# EAGLE design Buzzer_Card (EAGLE 6.4)

## Sheet 1 of 2
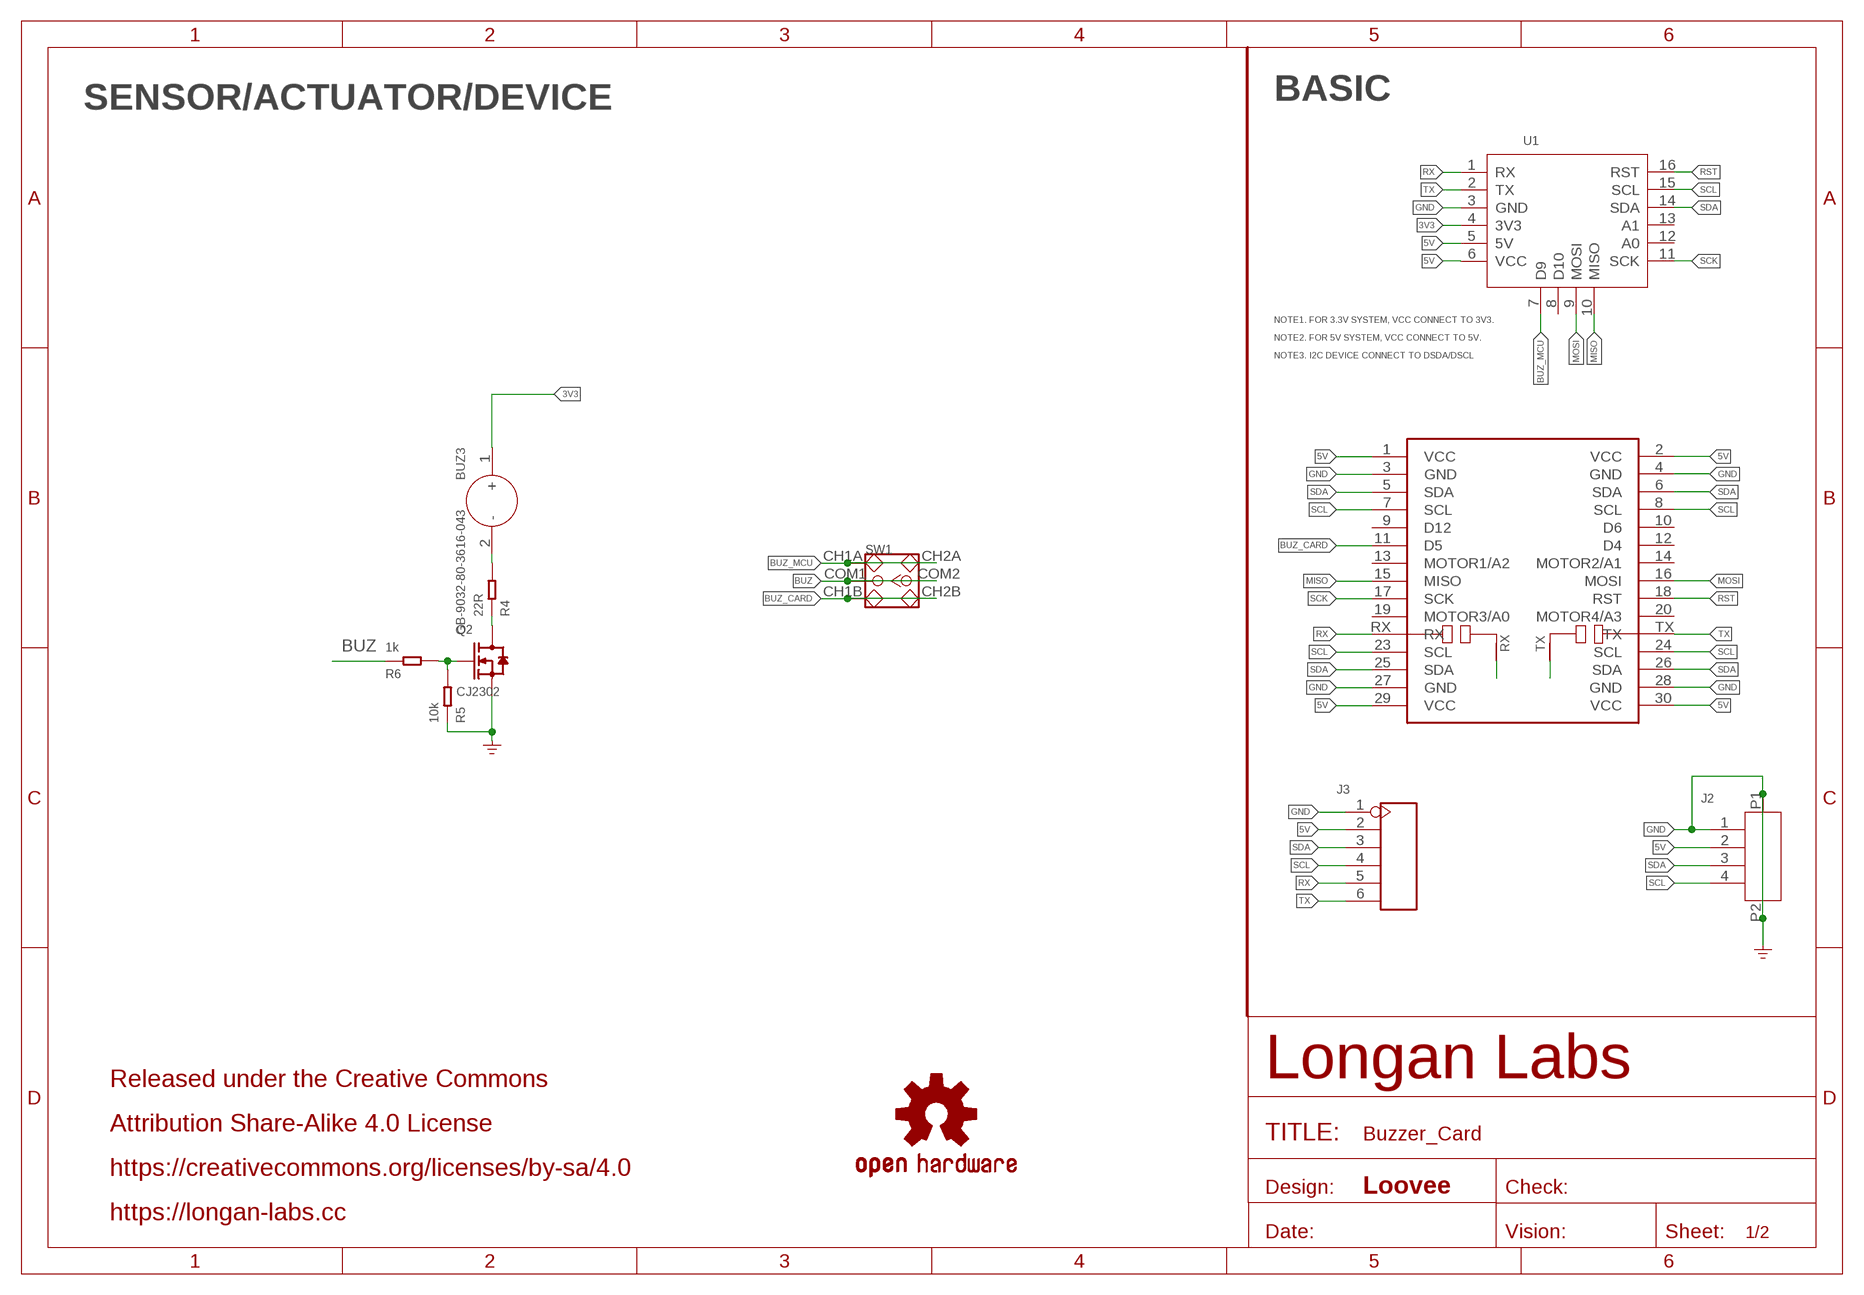
[diagram p0: schematic, sheet 1]

### Parts
BUZ3  GB-9032-80-3616-043  BUZZER-9X3.2MM  [BZ2-SMD-9X10.6X3.2MM]
J2  HEADER-4P-1.0  [4P-1.0-90D]
J3  HEADER-6P-55/35MIL  [H6-2.54]
LOGO2  OSHW-LOGOS  [OSHW-LOGO-S]
MOUDLE2  MOUDLE-CARDS-UART'BOARD'  [MOUDLE-2X15P-UART]
Q2  CJ2302  MOSFET-N'SOT23'  [SOT-23]
R4  22R  RES-0603  [R0603]
R5  10k  RES-0603  [R0603]
R6  1k  RES-0603  [R0603]
SW1  SWITCH-2CH-6P-SMD  [SW6-2.54-SMD-7.0X3.5X1.5MM]
U1  MOUDLE-CARDS  [16P-2.0-CARDS]

### Nets
3V3: BUZ3.1(+) U1.4(3V3)
5V: J2.2 J3.2 MOUDLE2.1(VCC) MOUDLE2.2(VCC) MOUDLE2.29(VCC) MOUDLE2.30(VCC) U1.5(5V) U1.6(VCC)
BUZ: R6.1 SW1.COM1 SW1.COM2
BUZ_CARD: MOUDLE2.11(D5) SW1.CH1B SW1.CH2B
BUZ_MCU: SW1.CH1A SW1.CH2A U1.7(D9)
GND: J2.1 J2.P1 J2.P2 J3.1 MOUDLE2.3(GND) MOUDLE2.4(GND) MOUDLE2.27(GND) MOUDLE2.28(GND) Q2.2(S) R5.1 U1.3(GND) ; supply symbol labelled GND_POWER
MISO: MOUDLE2.15(MISO) U1.10(MISO)
MOSI: MOUDLE2.16(MOSI) U1.9(MOSI)
N$1: Q2.3(D) R4.1
N$2: MOUDLE2.RX/N1(RX/N) MOUDLE2.RX/N2(RX/N)
N$3: Q2.1(G) R5.2 R6.2
N$4: BUZ3.2(-) R4.2
N$5: MOUDLE2.TX/N1(TX/N) MOUDLE2.TX/N2(TX/N)
RST: MOUDLE2.18(RST) U1.16(RST)
RX: J3.5 MOUDLE2.RX U1.1(RX)
SCK: MOUDLE2.17(SCK) U1.11(SCK)
SCL: J2.4 J3.4 MOUDLE2.7(SCL) MOUDLE2.8(SCL) MOUDLE2.23(SCL) MOUDLE2.24(SCL) U1.15(SCL)
SDA: J2.3 J3.3 MOUDLE2.5(SDA) MOUDLE2.6(SDA) MOUDLE2.25(SDA) MOUDLE2.26(SDA) U1.14(SDA)
TX: J3.6 MOUDLE2.TX U1.2(TX)
Unconnected: MOUDLE2.9(D12) MOUDLE2.10(D6) MOUDLE2.12(D4) MOUDLE2.13(MOTOR1/A2) MOUDLE2.14(MOTOR2/A1) MOUDLE2.19(MOTOR3/A0) MOUDLE2.20(MOTOR4/A3) U1.8(D10) U1.12(A0) U1.13(A1)

### Notes on the sheet
- SENSOR/ACTUATOR/DEVICE | BASIC
- NOTE1. FOR 3.3V SYSTEM, VCC CONNECT TO 3V3.
- NOTE2. FOR 5V SYSTEM, VCC CONNECT TO 5V.
- NOTE3. I2C DEVICE CONNECT TO DSDA/DSCL
- Released under the Creative Commons
- Attribution Share-Alike 4.0 License
- https://creativecommons.org/licenses/by-sa/4.0
- Loovee
- https://longan-labs.cc

## Sheet 2 of 2

## Library data of the parts
BUZ3 = Discrete-new:BUZZER: BZ2-5.0-D9.0XH5.5MM: 312020001;BZ2-7.6-D12.0XH6.5MM: 312020006; BZ3-SMD-5.0X5.0X2.5MM:312020004
J2 = Longan-Connect:HEADER-4P-1.0
J3 = Connector-new:HEADER-6P
LOGO2 = SparkFun-Aesthetics:OSHW-LOGO: Open-Source Hardware (OSHW) Logo This logo indicates the piece of hardware it is found on incorporates a OSHW license and/or adheres to the definition of open source hardware found here: http://freedomdefined.org/OSHW
MOUDLE2 = Longan-moudle:MOUDLE-CARDS-UART
Q2 = Discrete-new:MOSFET-N
R4-R6 = Discrete-new:RES
SW1 = Discrete-new:SWITCH-2CH-6P: SW6-2.54-9.0X3.5X3.2+2.0MM:311010004;SW6-2.54-9.0X3.5X3.2-90D:311030004;SW6-2.54-SMD-7.0X3.5X1.5MM:311030005
U1 = MOUDLE-CARDS:MOUDLE-CARDS

## Board
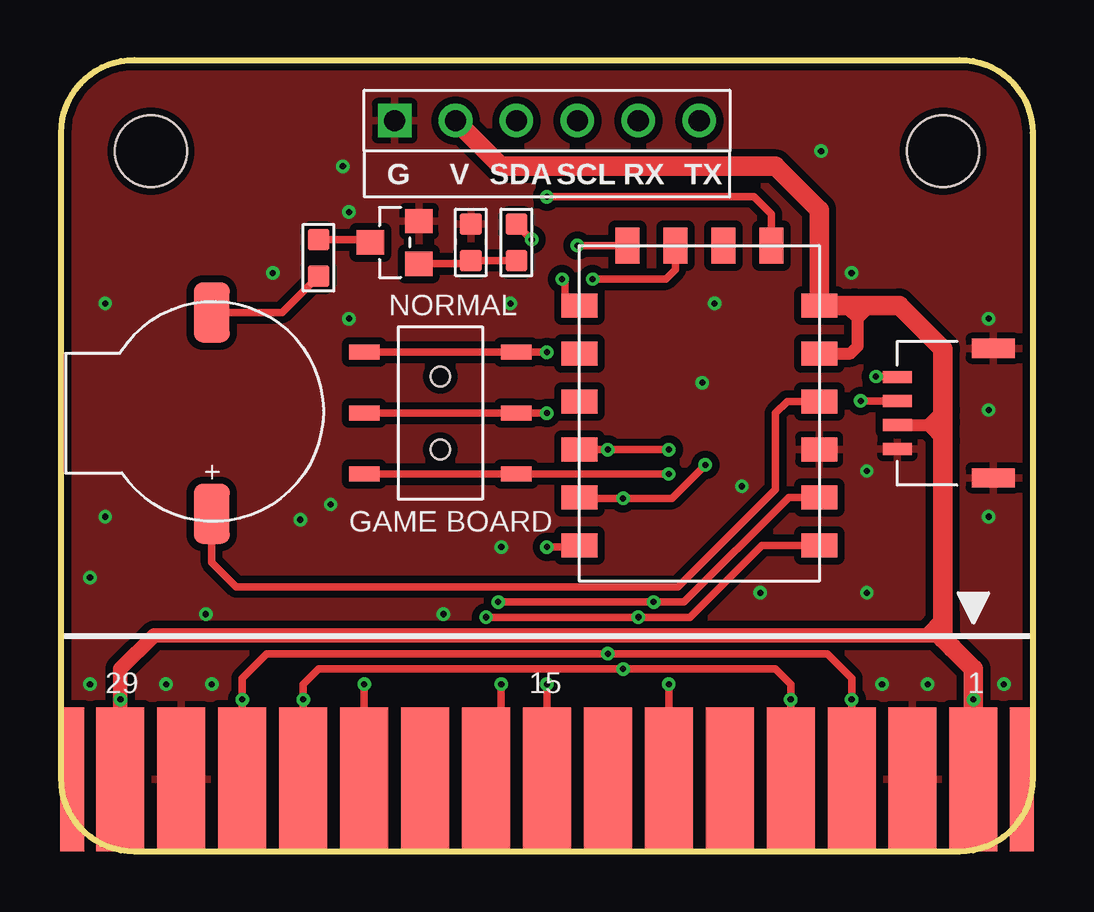
[diagram p1: board, top side]
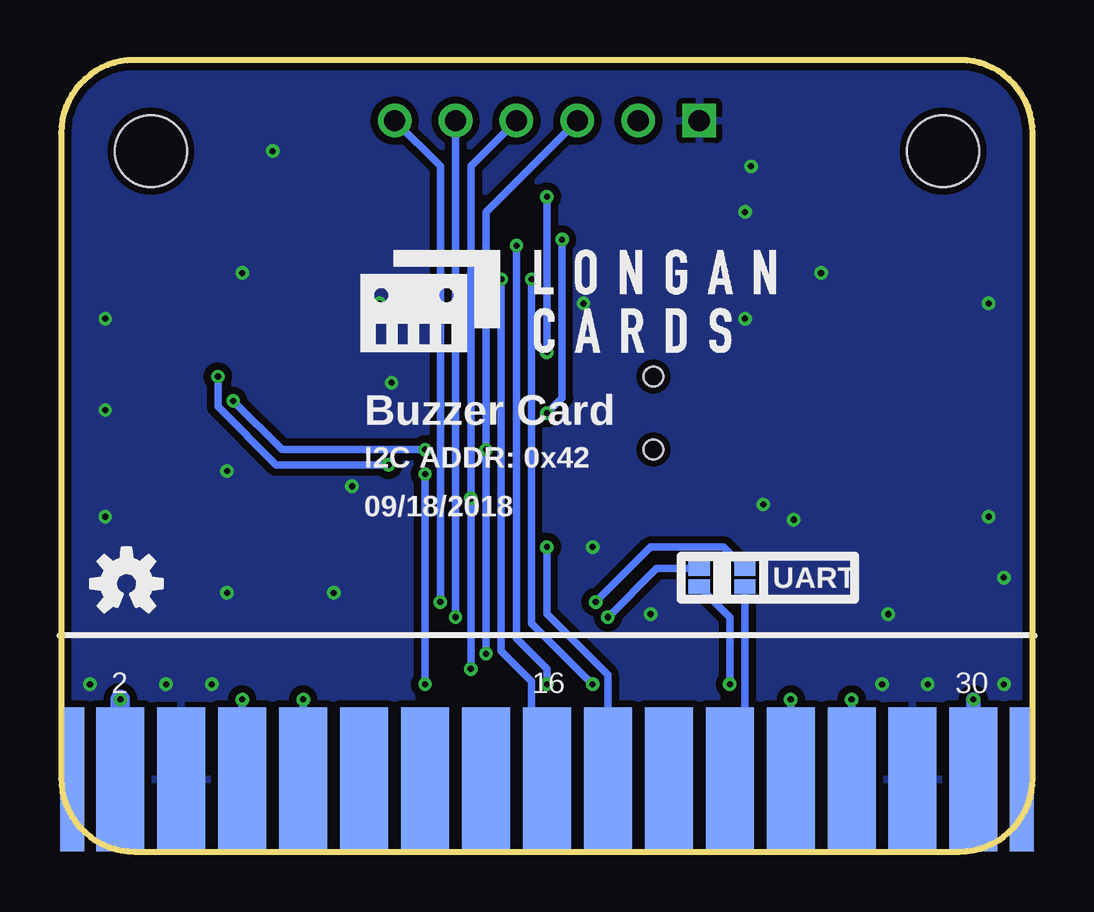
[diagram p2: board, bottom side, seen from below]

Size 40.5 x 33 mm. Coordinates in mm from the lower left corner, seen from the top.
Copper layers (1*16): Top 0.035mm / dielectric 1.5mm / Bottom 0.035mm
Design rules "SeeedStudio_2layer_DRU_no_angle_20140221 *": minimum track width 6mil, minimum drill 10mil, track to track 6mil, track to pad 6mil, pad to pad 6mil, via to via 6mil, smd to smd 0mil, copper to edge 10mil, drill to drill 10mil, minimum pad ring 10mil, minimum via ring 6mil, stop-mask expansion 2mil, vias tented up to drill 25mil, thermal gap 10mil

### Footprints (pad centres in the part's own frame; a part is rotated, then mirrored left to right if it is on the bottom)
BZ2-SMD-9X10.6X3.2MM = smd 2.5 x 1.5: 1 4.2,0; 2 -4.2,0
4P-1.0-90D = smd 1.2 x 0.5: 1 0,1.5; 2 0,0.5; 3 0,-0.5; 4 0,-1.5 | smd 1.8 x 0.8: P1 -4,2.7; P2 -4,-2.7
H6-2.54 = drill 0.889 pad 1.397 square: 1 0,6.35 | drill 0.889 pad 1.397: 2 0,3.81; 3 0,1.27; 4 0,-1.27; 5 0,-3.81; 6 0,-6.35
MOUDLE-2X15P-UART = smd 2 x 6: 1 17.78,-13.492; 3 15.24,-13.492; 5 12.7,-13.492; 7 10.16,-13.492; 9 7.62,-13.492; 11 5.08,-13.492; 13 2.54,-13.492; 15 0,-13.492; 17 -2.54,-13.492; 19 -5.08,-13.492; 23 -10.16,-13.492; 25 -12.7,-13.492; 27 -15.24,-13.492; 29 -17.78,-13.492; RX/N2 -7.62,-13.492 | smd 2 x 6 bottom: 2 17.78,-13.492; 4 15.24,-13.492; 6 12.7,-13.492; 8 10.16,-13.492; 10 7.62,-13.492; 12 5.08,-13.492; 14 2.54,-13.492; 16 0,-13.492; 18 -2.54,-13.492; 20 -5.08,-13.492; 24 -10.16,-13.492; 26 -12.7,-13.492; 28 -15.24,-13.492; 30 -17.78,-13.492; TX/N2 -7.62,-13.492 | smd 1 x 6: P1 -19.8,-13.492; P4 19.8,-13.492 | smd 1 x 6 bottom: P2 -19.8,-13.492; P3 19.8,-13.492 | smd 0.889 x 0.61 bottom: RX -6.35,-4.699; RX/N1 -6.35,-5.461; TX -8.255,-4.699; TX/N1 -8.255,-5.461 | hole 3: -16.51,12.7; 16.51,12.7
SOT-23 = smd 1.143 x 1.016: 1 1.016,-0.889; 2 1.016,0.889; 3 -1.016,0
R0603 = smd 0.889 x 0.889: 1 0,0.762; 2 0,-0.762
SW6-2.54-SMD-7.0X3.5X1.5MM = smd 1.27 x 0.635: CH1A -3.175,2.54; CH1B -3.175,-2.54; CH2A 3.175,2.54; CH2B 3.175,-2.54; COM1 -3.175,0; COM2 3.175,0 | hole 0.813: 0,1.524; 0,-1.524
16P-2.0-CARDS = smd 1.5 x 1: 1 -5,5; 2 -5,3; 3 -5,1; 4 -5,-1; 5 -5,-3; 6 -5,-5; 11 5,-5; 12 5,-3; 13 5,-1; 14 5,1; 15 5,3; 16 5,5 | smd 1 x 1.5: 7 -3,-7.5; 8 -1,-7.5; 9 1,-7.5; 10 3,-7.5

### Placement (x,y rotation side)
BUZ3  6.28,18.28 270 top
J2  34.86,18.28 180 top
J3  20.25,30.47 90 top
LOGO2  37.78,11.17 0 bottom
MOUDLE2  20.25,16.5 0 top
Q2  13.9,25.39 0 top
R4  10.72,24.76 0 top
R5  17.07,25.39 0 top
R6  18.98,25.39 0 top
SW1  15.8,18.28 0 top
U1  26.6,17.77 180 top
U$1  [LONGAN-CARDS-MIDDLE]  28.76,20.31 0 bottom

### Tracks (layer width: path | path; a pad name or v marks a point on that pad's centre or on a via)
3V3
  Top 0.305: U1.4 30.27,18.77 29.77,18.28 29.77,15.1 25.71,11.04 7.3,11.04 6.28,12.05 BUZ3.1
5V  (via drill 0.25 pad 0.51)
  Top 0.305: 35.24,9.01 35.87,9.01 36.76,9.9
  Top 0.508: 38.03,6.47 v38.03,6.34 | J2.2 36.12,17.78 | 36.13,17.78 36.64,17.78 36.76,17.9 | 36.12,17.78 36.13,17.78 | 36.13,17.78 36.76,18.41 | 36.12,17.78 36.76,17.14 | U1.5 32.9,20.77 33.2,21.07 33.2,22.21 | 33.2,22.21 33.2,22.64 33.08,22.77 | 33.2,22.21 32.82,22.6 | 33.2,22.21 33.71,22.72
  Top 0.61: 37.14,8.5 37.01,8.5 36.51,9.01 | 36.38,9.13 36.51,9.01 | 36.51,9.01 35.24,9.01 3.87,9.01 2.47,7.61 v2.47,6.34 MOUDLE2.30
  Top 0.813: J3.2 18.34,28.56 29.77,28.56 31.6,26.74 U1.6 33.08,22.77 34.94,22.77 36.76,20.95 36.76,18.41 36.76,17.9 36.76,17.14 36.76,9.9 36.76,8.88 37.14,8.5 38.03,7.61 38.03,6.47 MOUDLE2.2
  Bottom 0.61: v2.47,6.34 MOUDLE2.30
  Bottom 0.813: v38.03,6.34 MOUDLE2.2
BUZ  (via drill 0.25 pad 0.51)
  Top 0.305: SW1.COM1 SW1.COM2 v20.25,18.28 | v19.61,25.52 R6.1
  Bottom 0.305: v20.25,18.28 19.61,18.91 v19.61,25.52
BUZ_CARD  (via drill 0.25 pad 0.51)
  Top 0.305: v25.33,15.74 SW1.CH2B SW1.CH1B | v25.33,6.97 MOUDLE2.11
  Bottom 0.305: v25.33,6.97 v25.33,15.74
BUZ_MCU  (via drill 0.25 pad 0.51)
  Top 0.305: SW1.CH1A SW1.CH2A v20.25,20.82 | U1.7 29.6,26.58 28.89,27.3 v20.25,27.3
  Bottom 0.305: v20.25,27.3 v20.25,20.82
GND  (via drill 0.25 pad 0.51)
  other vias: 34.22,6.97 36.12,6.97 39.3,6.97 4.38,6.97 6.28,6.97 1.2,6.97 1.2,11.42 33.59,15.87 38.66,18.41 29.14,10.79 33.59,10.79 38.66,13.96 38.66,22.21 32.95,24.12 31.68,29.2 26.73,19.55 27.23,22.85 18.73,22.85 11.99,22.21 11.74,28.56 11.99,26.66 8.82,24.12 1.84,22.85 1.84,13.96 11.23,14.47 6.03,9.9 9.96,13.83 28.38,15.23 15.93,9.9 18.34,12.69
  pour Top (isolate 0.305): -0.07,33.01 40.57,33.01 40.57,-0.01 -0.07,-0.01
  pour Bottom (isolate 0.305): -0.07,33.01 40.57,33.01 40.57,-0.01 -0.07,-0.01
MISO  (via drill 0.25 pad 0.51)
  Top 0.305: v21.52,25.26 U1.10 | v20.25,6.97 MOUDLE2.15
  Bottom 0.305: v20.25,6.97 20.25,7.61 21.52,8.88 v21.52,25.26
MOSI  (via drill 0.25 pad 0.51)
  Top 0.305: v22.16,23.87 25.2,23.87 25.6,24.26 U1.9
  Bottom 0.305: v22.16,23.87 22.16,8.37 20.89,7.1 20.89,4.44 20.63,4.18 20.63,3.39 MOUDLE2.16
N$1
  Top 0.305: R4.1 12.76,25.52 Q2.3
N$2  (via drill 0.25 pad 0.51)
  Top 0.305: MOUDLE2.RX/N2 v12.63,6.97
  Bottom 0.305: v12.63,6.97 12.63,9.77 MOUDLE2.RX/N1
N$3
  Top 0.305: R6.2 R5.2 16.95,24.5 Q2.1
N$4
  Top 0.305: BUZ3.2 9.21,22.48 R4.2
N$5
  Bottom 0.305: MOUDLE2.TX/N1 11.99,3.64 MOUDLE2.TX/N2
RST  (via drill 0.25 pad 0.51)
  Top 0.305: v20.25,12.69 21.52,12.69 U1.16
  Bottom 0.305: v20.25,12.69 20.25,9.9 17.71,7.36 MOUDLE2.18
RX  (via drill 0.25 pad 0.51)
  Top 0.305: U1.1 29.22,12.77 26.22,9.77 v24.06,9.77 v17.71,9.77
  Bottom 0.305: J3.5 v24.06,9.77 | MOUDLE2.RX 15.68,11.8 v17.71,9.77
SCK  (via drill 0.25 pad 0.51)
  Top 0.305: 21.55,22.72 21.55,22.82 21.52,22.85 | v20.89,23.87 21.01,23.74 21.01,22.72 21.55,22.72 | 21.55,22.72 U1.11 | v18.34,6.97 18.34,3.64 MOUDLE2.17
  Bottom 0.305: v18.34,6.97 20.89,9.52 v20.89,23.87
SCL  (via drill 0.25 pad 0.51)
  Top 0.305: U1.15 21.65,14.72 v23.43,14.72 25.46,14.72 v26.85,16.12 | v33.97,19.8 34.83,19.8 J2.4 | MOUDLE2.23 v10.09,6.34 10.09,6.97 10.72,7.61 v23.43,7.61 29.77,7.61 30.41,6.97 30.41,6.72 v30.41,6.34 MOUDLE2.8
  Bottom 0.305: J3.4 23.43,28.56 v23.43,14.72 v23.43,7.61 | v26.85,16.12 31.54,16.12 33.97,18.55 v33.97,19.8 | v10.09,6.34 MOUDLE2.23 | v30.41,6.34 MOUDLE2.8
SDA  (via drill 0.25 pad 0.51)
  Top 0.305: v22.79,16.75 22.77,16.77 U1.14 25.31,16.77 v25.33,16.75 | v33.33,18.79 34.85,18.79 J2.3 | MOUDLE2.25 v7.55,6.34 7.55,7.23 8.57,8.24 v22.79,8.24 31.93,8.24 32.95,7.23 v32.95,6.34 MOUDLE2.6
  Bottom 0.305: J3.3 22.79,26.66 v22.79,16.75 v22.79,8.24 | v25.33,16.75 31.3,16.75 v33.33,18.79 | v7.55,6.34 MOUDLE2.25 | v32.95,6.34 MOUDLE2.6
TX  (via drill 0.25 pad 0.51)
  Top 0.305: U1.2 30.33,14.77 25.96,10.4 v24.7,10.4 v18.22,10.4
  Bottom 0.305: J3.6 24.7,28.56 v24.7,10.4 | v18.22,10.4 15.93,12.69 12.88,12.69 MOUDLE2.TX

### Text on the board
tPlace: G | V | SDA | SCL | RX | TX | NORMAL | GAME BOARD
bPlace: Buzzer Card | I2C ADDR: 0x42 | 09/18/2018